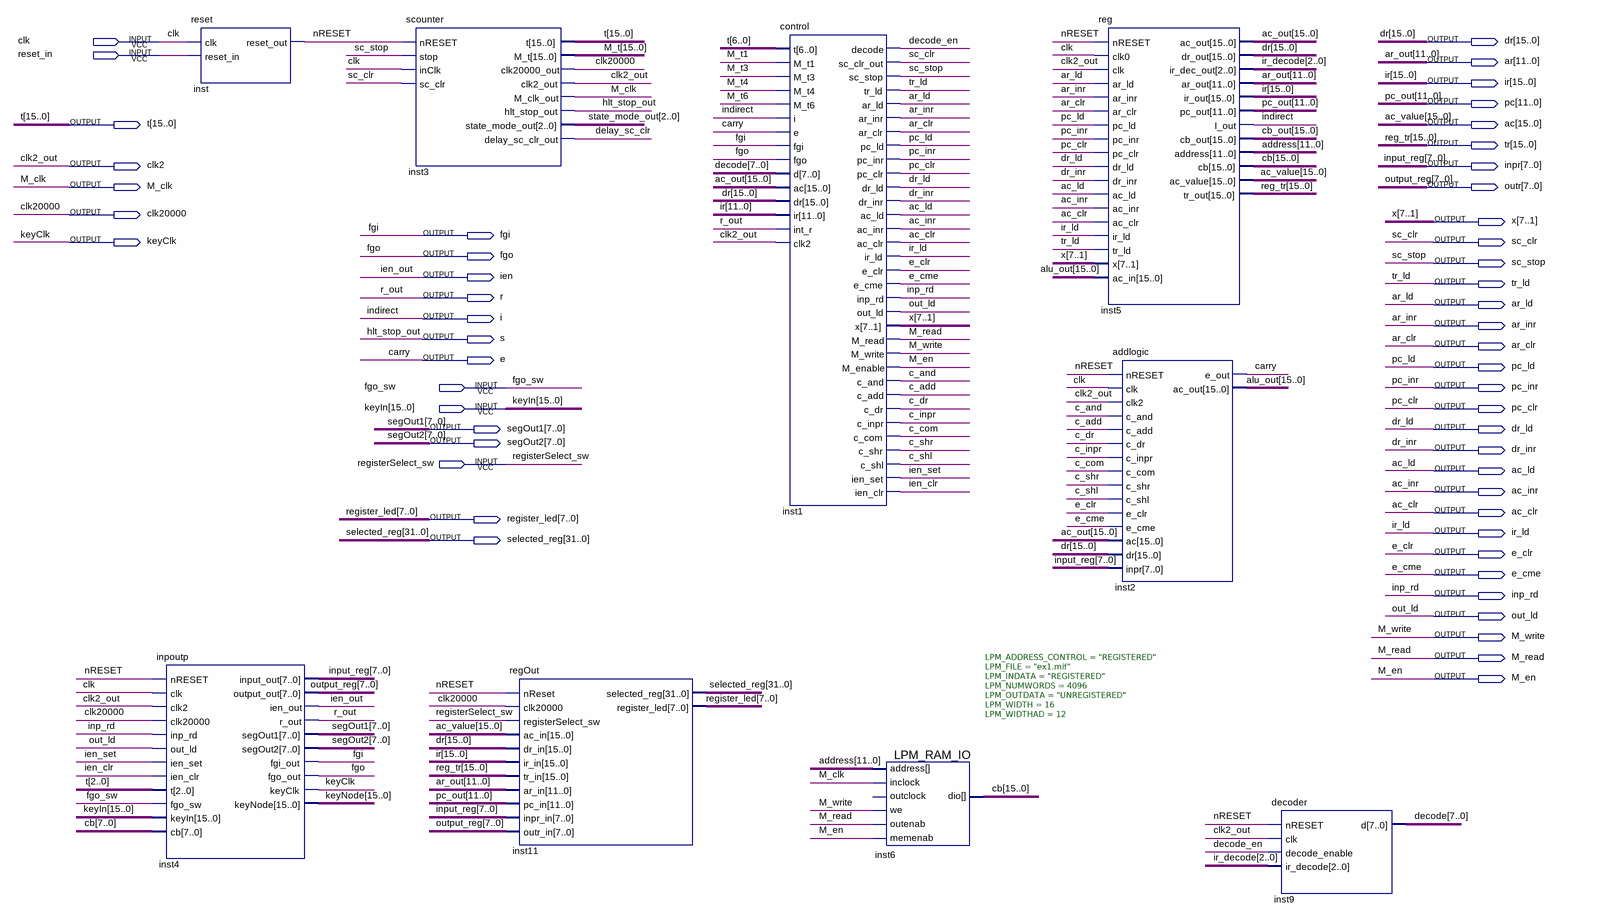
[diagram p0: schematic sheet]
// Quartus schematic digicom.bdf as structural Verilog: 9 symbols, 52 pins
module digicom (
  input  clk,
  input  reset_in,
  input  fgo_sw,
  input  [15:0] keyIn,
  input  registerSelect_sw,
  output [15:0] dr,
  output [11:0] ar,
  output [15:0] ir,
  output [11:0] pc,
  output [15:0] t,
  output [15:0] ac,
  output [15:0] tr,
  output clk2,
  output [7:0] inpr,
  output M_clk,
  output [7:0] outr,
  output clk20000,
  output [7:1] x,
  output fgi,
  output keyClk,
  output sc_clr,
  output fgo,
  output sc_stop,
  output ien,
  output tr_ld,
  output r,
  output ar_ld,
  output i,
  output ar_inr,
  output s,
  output ar_clr,
  output e,
  output pc_ld,
  output pc_inr,
  output pc_clr,
  output [7:0] segOut1,
  output dr_ld,
  output [7:0] segOut2,
  output dr_inr,
  output ac_ld,
  output ac_inr,
  output ac_clr,
  output [7:0] register_led,
  output ir_ld,
  output [31:0] selected_reg,
  output e_clr,
  output e_cme,
  output inp_rd,
  output out_ld,
  output M_write,
  output M_read,
  output M_en
);

  wire c_add, c_and, c_com, c_dr, c_inpr, c_shl, c_shr, decode_en, delay_sc_clr, ien_clr, ien_set, nRESET;
  wire [2:0] ir_decode, state_mode_out;
  wire [7:0] decode;
  wire [11:0] address;
  wire [15:0] ac_out, alu_out, cb, cb_out, keyNode, M_t;

  reset inst (.clk(clk), .reset_in(reset_in), .reset_out(nRESET));
  inpoutp inst4 (
    .nRESET(nRESET), .clk(clk), .clk2(clk2), .clk20000(clk20000), .inp_rd(inp_rd), .out_ld(out_ld),
    .ien_set(ien_set), .ien_clr(ien_clr), .t(t[2:0]), .fgo_sw(fgo_sw), .keyIn(keyIn), .cb(cb[7:0]),
    .input_out(inpr), .output_out(outr), .ien_out(ien), .r_out(r), .segOut1(segOut1), .segOut2(segOut2),
    .fgi_out(fgi), .fgo_out(fgo), .keyClk(keyClk), .keyNode(keyNode));
  scounter inst3 (
    .nRESET(nRESET), .stop(sc_stop), .inClk(clk), .sc_clr(sc_clr), .t(t), .M_t(M_t), .clk20000_out(clk20000),
    .clk2_out(clk2), .M_clk_out(M_clk), .hlt_stop_out(s), .state_mode_out(state_mode_out),
    .delay_sc_clr_out(delay_sc_clr));
  regOut inst11 (
    .nReset(nRESET), .clk20000(clk20000), .registerSelect_sw(registerSelect_sw), .ac_in(ac), .dr_in(dr),
    .ir_in(ir), .tr_in(tr), .ar_in(ar), .pc_in(pc), .inpr_in(inpr), .outr_in(outr),
    .selected_reg(selected_reg), .register_led(register_led));
  control inst1 (
    .t(t[6:0]), .M_t1(M_t[1]), .M_t3(M_t[3]), .M_t4(M_t[4]), .M_t6(M_t[6]), .i(i), .e(e), .fgi(fgi),
    .fgo(fgo), .d(decode), .ac(ac_out), .dr(dr), .ir(ir[11:0]), .int_r(r), .clk2(clk2), .decode(decode_en),
    .sc_clr_out(sc_clr), .sc_stop(sc_stop), .tr_ld(tr_ld), .ar_ld(ar_ld), .ar_inr(ar_inr), .ar_clr(ar_clr),
    .pc_ld(pc_ld), .pc_inr(pc_inr), .pc_clr(pc_clr), .dr_ld(dr_ld), .dr_inr(dr_inr), .ac_ld(ac_ld),
    .ac_inr(ac_inr), .ac_clr(ac_clr), .ir_ld(ir_ld), .e_clr(e_clr), .e_cme(e_cme), .inp_rd(inp_rd),
    .out_ld(out_ld), .x(x), .M_read(M_read), .M_write(M_write), .M_enable(M_en), .c_and(c_and),
    .c_add(c_add), .c_dr(c_dr), .c_inpr(c_inpr), .c_com(c_com), .c_shr(c_shr), .c_shl(c_shl),
    .ien_set(ien_set), .ien_clr(ien_clr));
  LPM_RAM_IO #(.LPM_ADDRESS_CONTROL("REGISTERED"), .LPM_FILE("ex1.mif"), .LPM_INDATA("REGISTERED"), .LPM_NUMWORDS(4096), .LPM_OUTDATA("UNREGISTERED"), .LPM_WIDTH(16), .LPM_WIDTHAD(12)) inst6 (
    .address(address), .memenab(M_en), .inclock(M_clk), .we(M_write), .outenab(M_read), .dio(cb));  // open: outclock
  \reg  inst5 (
    .nRESET(nRESET), .clk0(clk), .clk(clk2), .ar_ld(ar_ld), .ar_inr(ar_inr), .ar_clr(ar_clr), .pc_ld(pc_ld),
    .pc_inr(pc_inr), .pc_clr(pc_clr), .dr_ld(dr_ld), .dr_inr(dr_inr), .ac_ld(ac_ld), .ac_inr(ac_inr),
    .ac_clr(ac_clr), .ir_ld(ir_ld), .tr_ld(tr_ld), .x(x), .ac_in(alu_out), .ac_out(ac_out), .dr_out(dr),
    .ir_dec_out(ir_decode), .ar_out(ar), .ir_out(ir), .pc_out(pc), .I_out(i), .cb_out(cb_out),
    .address(address), .ac_value(ac), .tr_out(tr), .cb(cb));
  addlogic inst2 (
    .nRESET(nRESET), .clk(clk), .clk2(clk2), .c_and(c_and), .c_add(c_add), .c_dr(c_dr), .c_inpr(c_inpr),
    .c_com(c_com), .c_shr(c_shr), .c_shl(c_shl), .e_clr(e_clr), .e_cme(e_cme), .ac(ac_out), .dr(dr),
    .inpr(inpr), .e_out(e), .ac_out(alu_out));
  decoder inst9 (.nRESET(nRESET), .clk(clk2), .decode_enable(decode_en), .ir_decode(ir_decode), .d(decode));

  // Other names for the same wires on the sheet: ac_value[15:0] = ac; ar_out[11:0] = ar; carry = e; clk2_out = clk2;
  //   hlt_stop_out = s; ien_out = ien; indirect = i; input_reg[7:0] = inpr; output_reg[7:0] = outr; pc_out[11:0] = pc;
  //   r_out = r; reg_tr[15:0] = tr
endmodule
